# Altium schematic sheet [06] - BUTTONS - LEDS.SchDoc: Project
size A4; Organization: Tor Brodtkorb; Address1: Frode Rinnans veg 193; Address2: 7050 Trondheim; DocumentNumber: 6598; Revision: 1.0; SheetNumber: 1; SheetTotal: 1
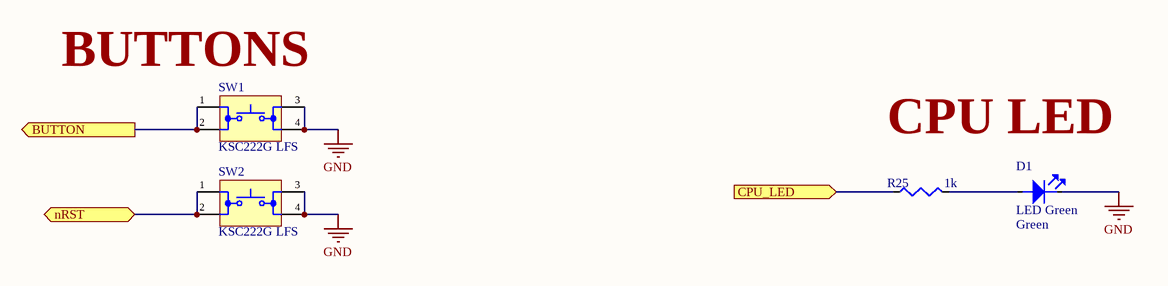
[diagram p0: [06] - BUTTONS - LEDS.SchDoc]

## Parts
D1  LED Green  Color: Green  [L0603 GREEN]
R25  value 1k  [R0603]  (hidden comment: CPF-A-0603B100KE1)
SW1  KSC222G LFS  [KSC222G LFS]
SW2  KSC222G LFS  [KSC222G LFS]

## Ports
BUTTON (out), CPU_LED (in), nRST (bidir)

## Nets
GND: D1.2 SW1.3 SW1.4 SW2.3 SW2.4
BUTTON: SW1.1 SW1.2 ; port BUTTON
CPU_LED: R25.1 ; port CPU_LED
nRST: SW2.1 SW2.2 ; port nRST
NetD1_1: D1.1 R25.2

## Notes on the sheet
- (near SW1) BUTTONS
- CPU LED
- Title
- Size:
- Date:
- A4
- Number:
- Time:
- Revision:
- Sheet
- of
- File:

## Library data of the parts
D1 = HSMG-C196: LED 0603 Green
R25 = CPF-A-0603B100KE1: R0603
SW1 SW2 = KSC222G LFS: Button SMD